# Altium project ZLS_MCU_New.PrjPCB (part 3 of 4)

## Sheet Power_Input.SchDoc: Power Input
size OrCAD A; DocumentNumber: LM-008; Revision: B; SheetNumber: 1; SheetTotal: 6; DocumentName: LM-008
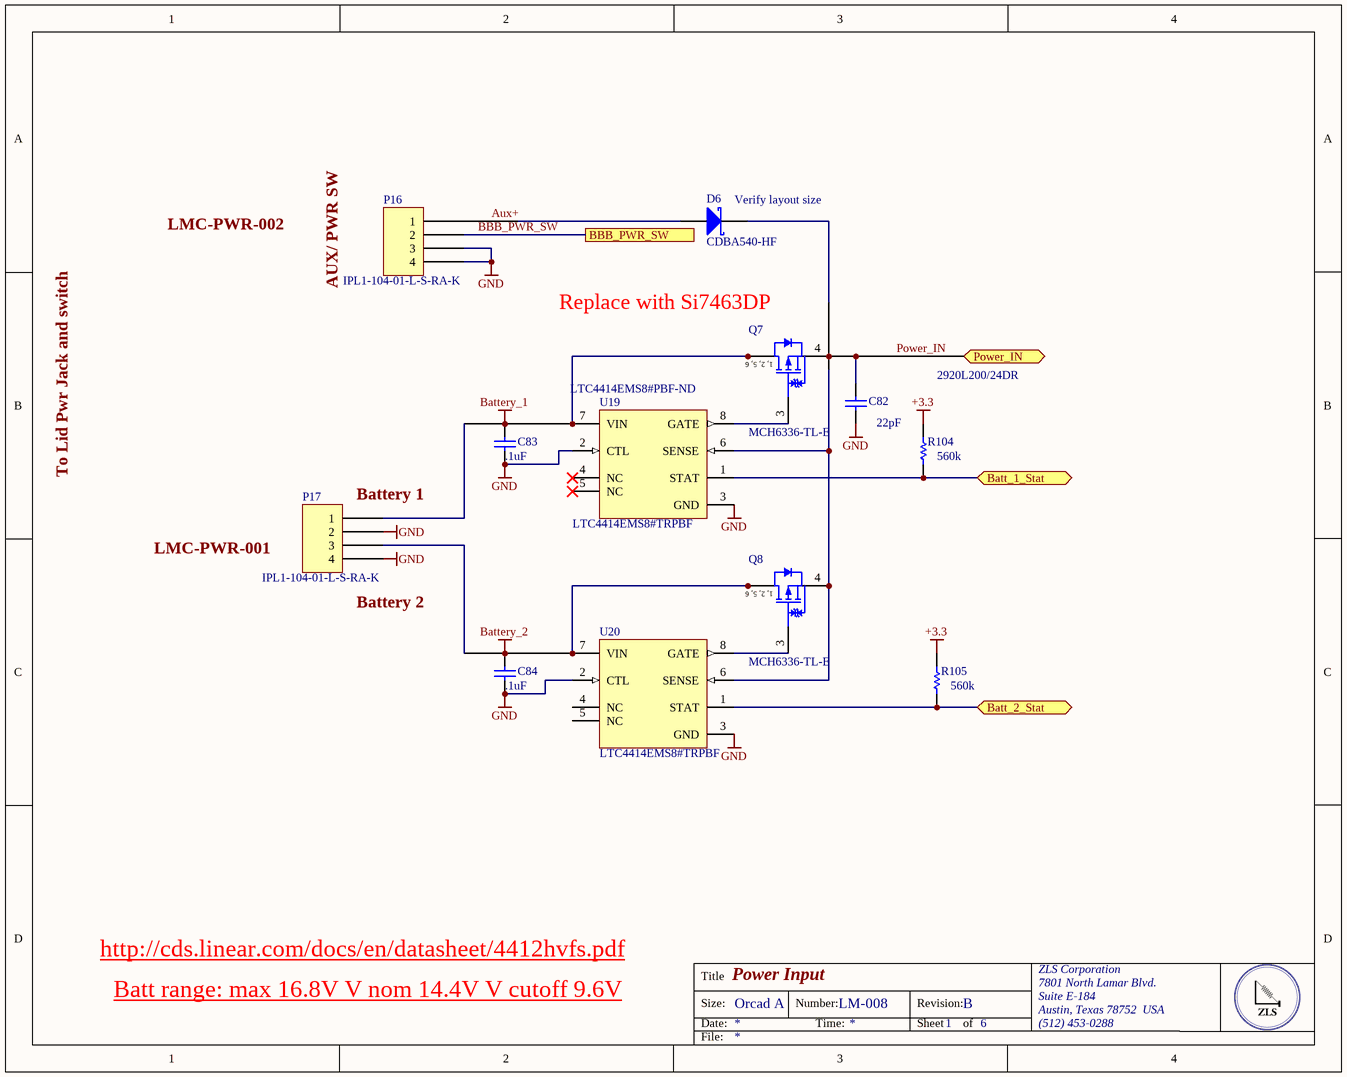
[diagram p5: Power_Input.SchDoc]

### Parts
C82  Capacitance: 22pF  [CAPC1206(3216)130_N]  (hidden comment: CAP CER 10UF 6.3V X5R 1206)
C83  Capacitance: .1uF  [CAPC1206(3216)130_N]  (hidden comment: CAP CER 10UF 6.3V X5R 1206)
C84  Capacitance: .1uF  [CAPC1206(3216)130_N]  (hidden comment: CAP CER 10UF 6.3V X5R 1206)
D6  CDBA540-HF  [VISH-DO-214AC-2_M]
P16  IPL1-104-01-L-S-RA-K  [IPL1-104-01-L-S-RA-K]
P17  IPL1-104-01-L-S-RA-K  [IPL1-104-01-L-S-RA-K]
Q7  MCH6336-TL-E  [ONSC-MCPH-6_V]
Q8  MCH6336-TL-E  [ONSC-MCPH-6_V]
R104  560k  [RESC0402(1005)_L]
R105  560k  [RESC0402(1005)_L]
U19  LTC4414EMS8#TRPBF  Supplier Part Number 1: LTC4414EMS8#PBF-ND  [LT-MS8-8_L]
U20  LTC4414EMS8#TRPBF  [LT-MS8-8_L]

### Ports
Batt_1_Stat, Batt_2_Stat, BBB_PWR_SW, Power_IN

### Nets
+3.3: R104.2 R105.2
Battery_1: C83.2 P17.1 Q7.1(D) Q7.2(D) Q7.5(D) Q7.6(D) U19.7(VIN)
Battery_2: C84.2 P17.3 Q8.1(D) Q8.2(D) Q8.5(D) Q8.6(D) U20.7(VIN)
GND: C82.1 C83.1 C84.1 P16.3 P16.4 P17.2 P17.4 U19.2(CTL) U19.3(GND) U20.2(CTL) U20.3(GND)
Aux+: D6.1(A) P16.1
BBB_PWR_SW: P16.2 ; port BBB_PWR_SW
Power_IN: C82.2 D6.2(K) Q7.4(S) Q8.4(S) U19.6(SENSE) U20.6(SENSE) ; port Power_IN
NetQ7_3: Q7.3(G) U19.8(GATE)
NetQ8_3: Q8.3(G) U20.8(GATE)
NetR104_1: R104.1 U19.1(STAT) ; port Batt_1_Stat
NetR105_1: R105.1 U20.1(STAT) ; port Batt_2_Stat

Not connected (* = marked no-connect by the designer): U19 4(NC)* 5(NC)*; U20 4(NC) 5(NC)

### Notes on the sheet
- (near D6) Verify layout size
- LMC-PWR-002
- AUX/ PWR SW
- (near Q7) Replace with Si7463DP
- 2920L200/24DR
- To Lid Pwr Jack and switch
- LMC-PWR-001
- (near P17) Battery 1
- (near P17) Battery 2
- http://cds.linear.com/docs/en/datasheet/4412hvfs.pdf
- Batt range: max 16.8V V nom 14.4V V cutoff 9.6V
- Title
- Size:
- Date:
- Orcad A
- Number:
- Time:
- Revision:
- Sheet
- of
- ZLS Corporation
- 7801 North Lamar Blvd.
- Suite E-184
- Austin, Texas 78752  USA
- (512) 453-0288
- File:
- (in symbol CMP-1058-00598-1) 1, 2, 5, 6

### Library data of the parts
C82-C84 = CMP-1037-04913-1: Manufacturer: Taiyo Yuden; Manufacturer Part Number: JMK316BJ106ML-T; Tolerance: ±20%; Notification: Current market demand for these product types have resulted in fluctuating and extending lead times. Lead times may differ.; Supplier 1: Digi-Key; Supplier Part Number 1: 587-5447-1-ND; RoHS: RoHS Compliant; Category: Capacitors; Stock 1: 5600; Pricing 1: 1=0.24, 10=0.161, 100=0.0817, 500=0.05592, 1000=0.04946 (USD); Packaging: Cut Tape (CT); Part Status: Active; Voltage - Rated: 6.3V; Temperature Coefficient: X5R; Operating Temperature: -55°C ~ 85°C; Features: -; Ratings: -; Applications: SMPS Filtering; Failure Rate: -; Mounting Type: Surface Mount, MLCC; Package / Case: 1206 (3216 Metric); Size / Dimension: 0.126" L x 0.063" W (3.20mm x 1.60mm); Height - Seated (Max): -; Thickness (Max): 0.071" (1.80mm); Lead Spacing: -; Lead Style: -; ComponentLink1URL: http://ds.yuden.co.jp/TYCOMPAS/ut/detail.do?productNo=JMK316BJ106ML-T&fileName=JMK316BJ106ML-T_SS&mode=specSheetDownload; ComponentLink1Description: http://ds.yuden.co.jp/TYCOMPAS/ut/detail.do?productNo=JMK316BJ106ML-T&fileName=JMK316BJ106ML-T_SS&mode=specSheetDownload
D6 = D Schottky: DIODE SCHOTTKY 40V 5A DO214AB; Manufacturer: Comchip Technology; Speed: Fast Recovery =< 500ns, > 200mA (Io); Capacitance @ Vr, F: 380pF @ 4V, 1MHz; Supplier 1: Digi-Key; Supplier Part Number 1: 641-1707-6-ND; Manufacturer Part Number: CDBA540-HF; RoHS: RoHS Compliant; Category: Discrete Semiconductor Products; Stock 1: 7367; Pricing 1: 1=0.49, 10=0.381, 25=0.3208, 100=0.2612, 250=0.2164, 500=0.1791, 1000=0.13432, 2500=0.12313 (USD); Packaging: Digi-Reel®; Part Status: Active; Diode Type: Schottky; Current - Average Rectified (Io): 5A; Mounting Type: Surface Mount; Package / Case: DO-214AC, SMA; Supplier Device Package: DO-214AC (SMA); Operating Temperature - Junction: -50°C ~ 150°C; ComponentLink1URL: http://www.comchiptech.com/cms/UserFiles/CDBA540-HF%20Thru505315.%20CDBA5200-HF%20RevC.pdf; ComponentLink1Description: http://www.comchiptech.com/cms/UserFiles/CDBA540-HF%20Thru505315.%20CDBA5200-HF%20RevC.pdf
P16 P17 = IPL1-104-01-L-S-RA-K: Manufacturer: Samtec Inc.; Connector Type: Header; Pitch - Mating: 0.100" (2.54mm); Number of Positions: 4; Number of Positions Loaded: All; Style: Board to Cable/Wire; Shrouding: Shrouded - 4 Wall; Contact Length - Mating: 0.215" (5.46mm); Contact Length - Post: 0.085" (2.16mm); Material Flammability Rating: UL94 V-0; Voltage Rating: 675VAC, 954VDC; Supplier 1: Digi-Key; Supplier Part Number 1: SAM9597-ND; Manufacturer Part Number: IPL1-104-01-L-S-RA-K; RoHS: RoHS Compliant; Category: Connectors, Interconnects; Stock 1: 265; Pricing 1: 1=2.53, 10=2.424, 100=2.02, 500=1.717, 1000=1.4645, 5000=1.313 (USD); Packaging: Tube; Part Status: Active; Contact Type: Male Pin; Number of Rows: 1; Row Spacing - Mating: -; Mounting Type: Through Hole, Right Angle; Termination: Solder; Fastening Type: Locking Ramp; Overall Contact Length: -; Insulation Height: 0.240" (6.10mm); Contact Shape: Square; Contact Finish - Mating: Gold; Contact Finish Thickness - Mating: 10µin (0.25µm); Contact Finish - Post: Tin; Contact Material: Phosphor Bronze; Insulation Material: Liquid Crystal Polymer (LCP); Features: -; Operating Temperature: -55°C ~ 125°C; Ingress Protection: -; Insulation Color: Natural; Current Rating: -; Mated Stacking Heights: -; Contact Finish Thickness - Post: -; Applications: -; ComponentLink1URL: http://suddendocs.samtec.com/prints/ipl1-1xx-xx-xxx-s-xx-x-xx-mkt.pdf; ComponentLink1Description: http://suddendocs.samtec.com/prints/ipl1-1xx-xx-xxx-s-xx-x-xx-mkt.pdf
Q7 Q8 = CMP-1058-00598-1: P-Channel Power MOSFET, -12 V, -5 A, 43 mOhm, Single, 6-Pin MCPH, Pb-Free, Tape and Reel; Manufacturer: ON Semiconductor; Current - Continuous Drain (Id) @ 25°C: 5A (Ta); Drive Voltage (Max Rds On,  Min Rds On): 1.8V, 4.5V; Rds On (Max) @ Id, Vgs: 43 mOhm @ 3A, 4.5V; Vgs(th) (Max) @ Id: 1.4V @ 1mA; Vgs (Max): ±10V; Power Dissipation (Max): 1.5W (Ta); Supplier 1: Digi-Key; Supplier Part Number 1: MCH6336-TL-EOSCT-ND; Manufacturer Part Number: MCH6336-TL-E; RoHS: Request Inventory Verification; Category: Discrete Semiconductor Products; Stock 1: 3000; Pricing 1: 1=0.68, 10=0.569, 100=0.4264, 500=0.3127, 1000=0.24164 (USD); Packaging: Cut Tape (CT); Part Status: Active; FET Type: P-Channel; Technology: MOSFET (Metal Oxide); FET Feature: -; Operating Temperature: 150°C (TJ); Mounting Type: Surface Mount; Supplier Device Package: SC-88FL/MCPH6; Package / Case: 6-SMD, Flat Leads; ComponentLink1URL: http://www.onsemi.com/pub/Collateral/MCH6336-D.PDF; ComponentLink1Description: http://www.onsemi.com/pub/Collateral/MCH6336-D.PDF
R104 R105 = CMP-1011-00927-1: RES SMD 560K OHM 1% 1/10W 0402; Manufacturer: Panasonic Electronic Components; Manufacturer Part Number: ERJ-2RKF5603X; Power (Watts): 0.1W, 1/10W; Temperature Coefficient: ±100ppm/°C; Supplier 1: Digi-Key; Supplier Part Number 1: P560KLCT-ND; RoHS: RoHS Compliant; Category: Resistors; Stock 1: 193515; Pricing 1: 1=0.1, 10=0.056, 100=0.0227, 1000=0.01021, 2500=0.00886, 5000=0.00732 (USD); Packaging: Cut Tape (CT); Part Status: Active; Tolerance: ±1%; Composition: Thick Film; Features: Automotive AEC-Q200; Operating Temperature: -55°C ~ 155°C; Package / Case: 0402 (1005 Metric); Supplier Device Package: 0402; Size / Dimension: 0.039" L x 0.020" W (1.00mm x 0.50mm); Height - Seated (Max): 0.016" (0.40mm); Failure Rate: -; ComponentLink1URL: https://industrial.panasonic.com/cdbs/www-data/pdf/RDA0000/AOA0000C304.pdf; ComponentLink1Description: https://industrial.panasonic.com/cdbs/www-data/pdf/RDA0000/AOA0000C304.pdf
U19 U20 = CMP-0479-00214-1: Low Loss PowerPath Controller for Large PFET, 3 to 36 V Vin, 8-pin SOP (MS8-8), -40 to 85 degC, Pb-Free, Tape and Reel; Manufacturer: Linear Technology/Analog Devices; Manufacturer Part Number: LTC4414EMS8#PBF; FET Type: P-Channel; Ratio - Input:Output: 2:1; Internal Switch(s): No; Voltage - Supply: 3 V ~ 36 V; Supplier 1: Digi-Key; RoHS: RoHS Compliant; Category: Integrated Circuits (ICs); Stock 1: 414; Pricing 1: 1=3.79, 25=2.6928, 100=2.2236 (USD); Packaging: Tube; Part Status: Active; Type: Source Selector Switch; Current - Output (Max): -; Applications: Battery Backup, Industrial/Automotive, High Current Switch; Operating Temperature: -40°C ~ 85°C; Mounting Type: Surface Mount; Package / Case: 8-TSSOP, 8-MSOP (0.118", 3.00mm Width); Supplier Device Package: 8-MSOP; Base Part Number: LTC4414; ComponentLink1URL: http://www.linear.com/docs/9037; ComponentLink1Description: http://www.linear.com/docs/9037
  U20: Supplier Part Number 1: LTC4414EMS8#PBF-ND

## Sheet Signal_Conditioner.SchDoc: Signal Conditioner
size Tabloid; DocumentNumber: LM-001; Revision: C; SheetNumber: 2; SheetTotal: 2; DocumentName: Signal Conditioner
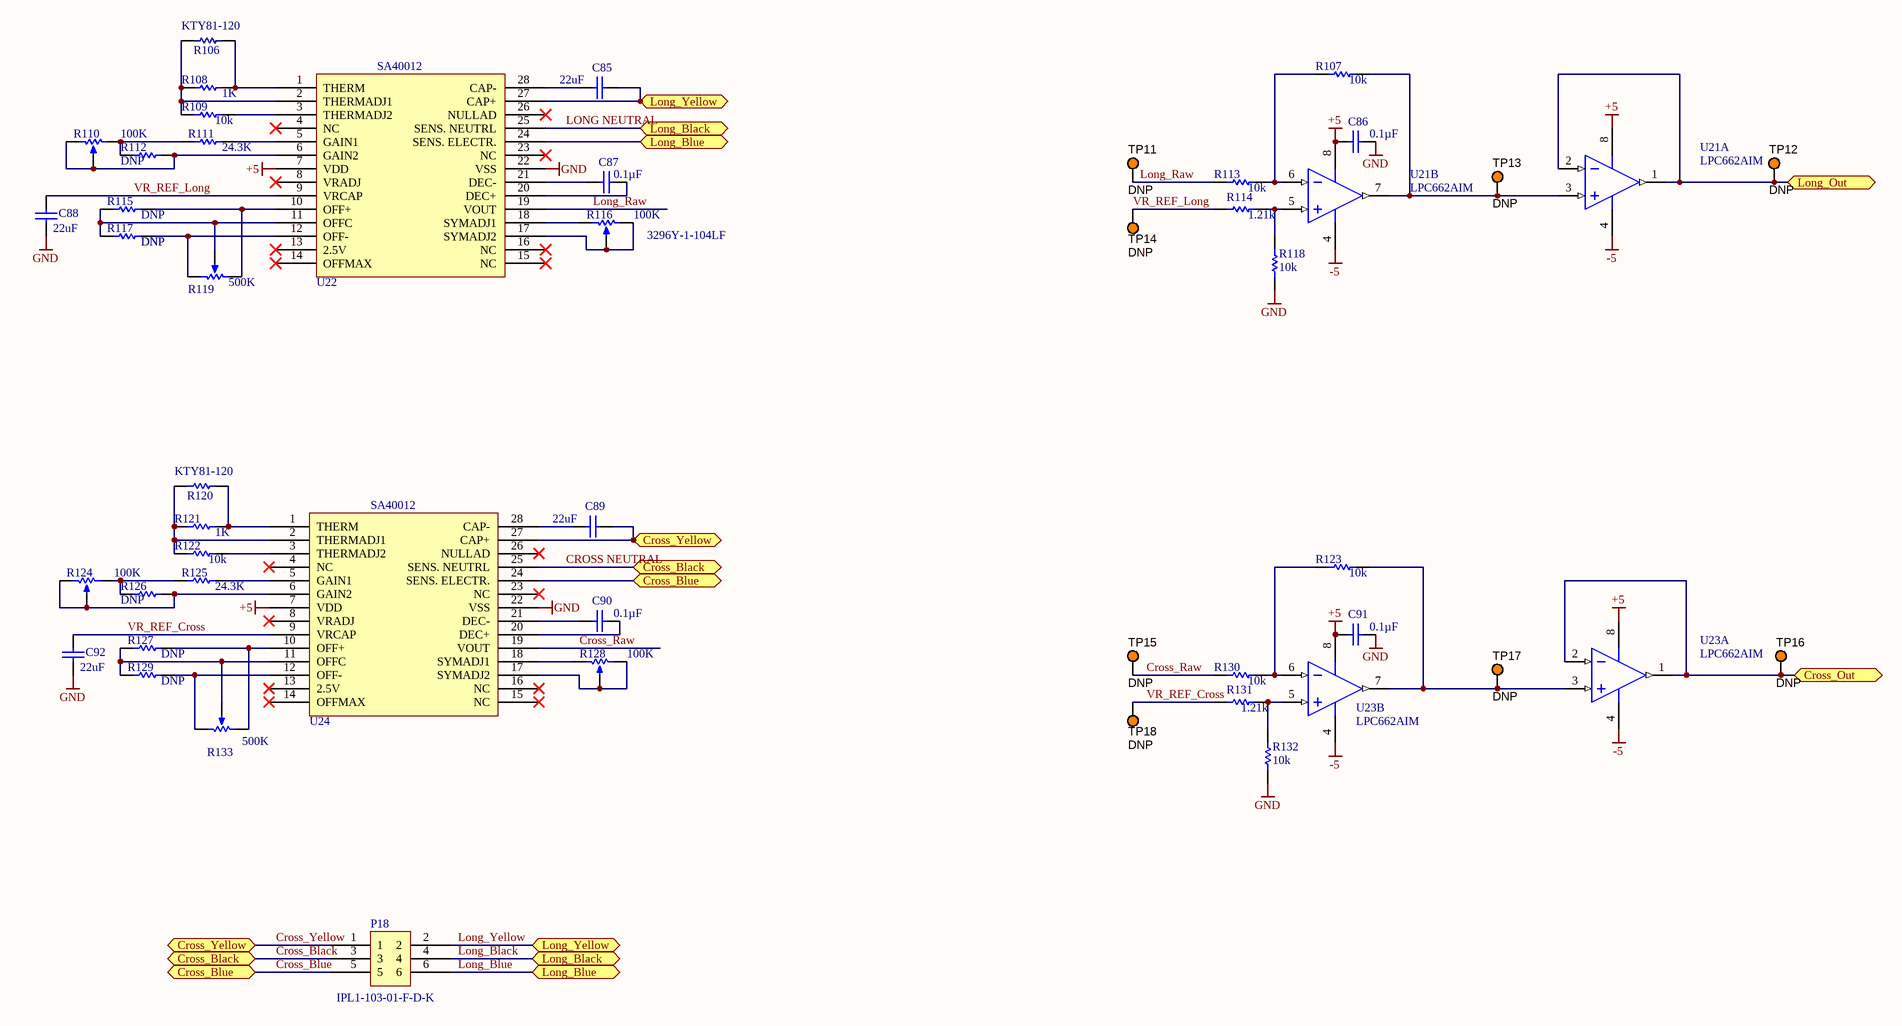
[diagram p6: Signal_Conditioner.SchDoc]

### Parts
C85  22uF  [CAPC0805(2012)145_N]
C86  Capacitance: 0.1µF  [CAPC0805(2012)145_N]  (hidden comment: CAP CER 0.1UF 25V X7R 0805)
C87  Capacitance: 0.1µF  [CAPC0805(2012)145_N]  (hidden comment: CAP CER 0.1UF 25V X7R 0805)
C88  22uF  [CAPC0805(2012)145_N]
C89  22uF  [CAPC0805(2012)145_N]
C90  Capacitance: 0.1µF  [CAPC0805(2012)145_N]  (hidden comment: CAP CER 0.1UF 25V X7R 0805)
C91  Capacitance: 0.1µF  [CAPC0805(2012)145_N]  (hidden comment: CAP CER 0.1UF 25V X7R 0805)
C92  22uF  [CAPC0805(2012)145_N]
P18  Manufacturer Part Number: IPL1-103-01-F-D-K  [IPL1-103-01-F-D]  (hidden comment: IPL1-103-01-F-D)
R106  KTY81-120  [KTY81-120]
R107  10k  [RESC0805(2012)_L]
R108  1K  [RESC0805(2012)_L]
R109  10k  [RESC0805(2012)_L]
R110  100K  [Trimmer 2.54]
R111  24.3K  [RESC0805(2012)_L]
R112  DNP  [RESC0805(2012)_L]
R113  10k  [RESC0805(2012)_L]
R114  1.21k  [RESC0805(2012)_L]
R115  DNP  [RESC0805(2012)_L]
R116  100K  [Trimmer 2.54]
R117  DNP  [RESC0805(2012)_L]
R118  10k  [RESC0805(2012)_L]
R119  500K  [Trimmer 2.54]
R120  KTY81-120  [KTY81-120]
R121  1K  [RESC0805(2012)_L]
R122  10k  [RESC0805(2012)_L]
R123  10k  [RESC0805(2012)_L]
R124  100K  [Trimmer 2.54]
R125  24.3K  [RESC0805(2012)_L]
R126  DNP  [RESC0805(2012)_L]
R127  DNP  [RESC0805(2012)_L]
R128  100K  [Trimmer 2.54]
R129  DNP  [RESC0805(2012)_L]
R130  10k  [RESC0805(2012)_L]
R131  1.21k  [RESC0805(2012)_L]
R132  10k  [RESC0805(2012)_L]
R133  500K  [Trimmer 2.54]
TP11  DNP  [KSTN-5003]
TP12  DNP  [KSTN-5003]
TP13  DNP  [KSTN-5003]
TP14  DNP  [KSTN-5003]
TP15  DNP  [KSTN-5003]
TP16  DNP  [KSTN-5003]
TP17  DNP  [KSTN-5003]
TP18  DNP  [KSTN-5003]
U21  LPC662AIM  [D0008A_M]  (parts A,B of 2)
U22  SA40012  [SA40012]
U23  LPC662AIM  [D0008A_M]  (parts A,B of 2)
U24  SA40012  [SA40012]

### Ports
Cross_Black, Cross_Blue, Cross_Out, Cross_Yellow, Long_Black, Long_Blue, Long_Out, Long_Yellow

### Nets
+5: C86.1 C91.1 U21.8(V+) U22.7(VDD) U23.8(V+) U24.7(VDD)
-5: U21.4(V-) U23.4(V-)
GND: C86.2 C88.2 C91.2 C92.2 R118.1 R132.1 U22.22(VSS) U24.22(VSS)
CROSS NEUTRAL: P18.3 U24.25(SENS._NEUTRL) ; port Cross_Black  [also labelled Cross_Black]
Cross_Blue: P18.5 U24.24(SENS._ELECTR.) ; port Cross_Blue
Cross_Raw: R130.1 TP15.1 U24.19(VOUT)
Cross_Yellow: C89.2 P18.1 U24.27(CAP+) ; port Cross_Yellow
LONG NEUTRAL: P18.4 U22.25(SENS._NEUTRL) ; port Long_Black  [also labelled Long_Black]
Long_Blue: P18.6 U22.24(SENS._ELECTR.) ; port Long_Blue
Long_Raw: R113.1 TP11.1 U22.19(VOUT)
Long_Yellow: C85.2 P18.2 U22.27(CAP+) ; port Long_Yellow
VR_REF_Cross: C92.1 R131.2 TP18.1 U24.9(VRCAP)
VR_REF_Long: C88.1 R114.2 TP14.1 U22.9(VRCAP)
NetC85_1: C85.1 U22.28(CAP-)
NetC87_1: C87.1 U22.21(DEC-)
NetC87_2: C87.2 U22.20(DEC+)
NetC89_1: C89.1 U24.28(CAP-)
NetC90_1: C90.1 U24.21(DEC-)
NetC90_2: C90.2 U24.20(DEC+)
NetR106_1: R106.1 R108.1 R109.1 U22.2(THERMADJ1)
NetR106_2: R106.2 R108.2 U22.1(THERM)
NetR107_1: R107.1 R113.2 U21.6(INB-)
NetR107_2: R107.2 TP13.1 U21.3(INA+) U21.7(OUTB)
NetR109_2: R109.2 U22.3(THERMADJ2)
NetR110_1: R110.1(a) R110.2(b) R112.2 U22.6(GAIN2)
NetR110_3: R110.3(c) R111.1 R112.1
NetR111_2: R111.2 U22.5(GAIN1)
NetR114_1: R114.1 R118.2 U21.5(INB+)
NetR115_1: R115.1 R117.1 R119.2(b) U22.11(OFFC)
NetR115_2: R115.2 R119.1(a) U22.10(OFF+)
NetR116_1: R116.1(a) U22.18(SYMADJ1)
NetR116_2: R116.2(b) R116.3(c) U22.17(SYMADJ2)
NetR117_2: R117.2 R119.3(c) U22.12(OFF-)
NetR120_1: R120.1 R121.1 R122.1 U24.2(THERMADJ1)
NetR120_2: R120.2 R121.2 U24.1(THERM)
NetR122_2: R122.2 U24.3(THERMADJ2)
NetR123_1: R123.1 R130.2 U23.6(INB-)
NetR123_2: R123.2 TP17.1 U23.3(INA+) U23.7(OUTB)
NetR124_1: R124.1(a) R124.2(b) R126.2 U24.6(GAIN2)
NetR124_3: R124.3(c) R125.1 R126.1
NetR125_2: R125.2 U24.5(GAIN1)
NetR127_1: R127.1 R129.1 R133.2(b) U24.11(OFFC)
NetR127_2: R127.2 R133.1(a) U24.10(OFF+)
NetR128_1: R128.1(a) U24.18(SYMADJ1)
NetR128_2: R128.2(b) R128.3(c) U24.17(SYMADJ2)
NetR129_2: R129.2 R133.3(c) U24.12(OFF-)
NetR131_1: R131.1 R132.2 U23.5(INB+)
NetTP12_1: TP12.1 U21.1(OUTA) U21.2(INA-) ; port Long_Out
NetTP16_1: TP16.1 U23.1(OUTA) U23.2(INA-) ; port Cross_Out

Not connected (* = marked no-connect by the designer): U22 4(NC)* 8(VRADJ)* 13(2.5V)* 14(OFFMAX)* 15(NC)* 16(NC)* 23(NC)* 26(NULLAD)*; U24 4(NC)* 8(VRADJ)* 13(2.5V)* 14(OFFMAX)* 15(NC)* 16(NC)* 23(NC)* 26(NULLAD)*

### Notes on the sheet
- (near R117) DNP
- (near R116) 3296Y-1-104LF
- Title
- Size:
- Date:
- Tabloid
- Number:
- Time:
- Revision:
- Sheet
- of
- ZLS Corporation
- 7801 North Lamar Blvd.
- Suite E-184
- Austin, Texas 78752  USA
- (512) 453-0288
- File:

### Library data of the parts
C85 C88 C89 C92 = CMP-1036-04795-1: CAP CER 22UF 16V X5R 0805; Manufacturer: Murata Electronics North America; Manufacturer Part Number: GRM219R61C226ME15L; Tolerance: ±20%; Notification: Current market demand for these product types have resulted in fluctuating and extending lead times. Lead times may differ.; Supplier 1: Digi-Key; Supplier Part Number 1: 490-9952-1-ND; RoHS: RoHS Compliant; Category: Capacitors; Stock 1: 200; Pricing 1: 1=0.51, 10=0.359, 100=0.2364, 500=0.1751, 1000=0.14884 (USD); Packaging: Cut Tape (CT); Part Status: Active; Voltage - Rated: 16V; Temperature Coefficient: X5R; Operating Temperature: -55°C ~ 85°C; Features: -; Ratings: -; Applications: General Purpose; Mounting Type: Surface Mount, MLCC; Package / Case: 0805 (2012 Metric); Size / Dimension: 0.079" L x 0.049" W (2.00mm x 1.25mm); Height - Seated (Max): -; Thickness (Max): 0.039" (1.00mm); Lead Spacing: -; Lead Style: -; ComponentLink1URL: http://search.murata.co.jp/Ceramy/image/img/A01X/G101/ENG/GRM219R61C226ME15-01.pdf; ComponentLink1Description: http://search.murata.co.jp/Ceramy/image/img/A01X/G101/ENG/GRM219R61C226ME15-01.pdf
C86 C87 C90 C91 = CMP-1036-04795-1: Manufacturer: Murata Electronics North America; Manufacturer Part Number: GRM21BR71E104KA01L; Tolerance: ±10%; Supplier 1: Digi-Key; Supplier Part Number 1: 490-1673-6-ND; RoHS: RoHS Compliant; Category: Capacitors; Stock 1: 891652; Pricing 1: 1=0.2, 10=0.145, 100=0.0683, 500=0.04788, 1000=0.03964 (USD); Packaging: Digi-Reel®; Part Status: Active; Voltage - Rated: 25V; Temperature Coefficient: X7R; Operating Temperature: -55°C ~ 125°C; Features: -; Ratings: -; Applications: General Purpose; Mounting Type: Surface Mount, MLCC; Package / Case: 0805 (2012 Metric); Size / Dimension: 0.079" L x 0.049" W (2.00mm x 1.25mm); Height - Seated (Max): -; Thickness (Max): 0.053" (1.35mm); Lead Spacing: -; Lead Style: -; ComponentLink1URL: http://www.murata.com/~/media/webrenewal/support/library/catalog/products/capacitor/mlcc/c02e.ashx; ComponentLink1Description: http://www.murata.com/~/media/webrenewal/support/library/catalog/products/capacitor/mlcc/c02e.ashx
P18 = IPL1-103-01-F-D: Manufacturer: SAMTEC; Supplier 1: Newark; Supplier Part Number 1: 51P2678; Stock 1: 0; Pricing 1: 1=1.8, 5000=1.56, 10000=1.46 (USD); ComponentLink1URL: https://webassistants.partcommunity.com/23d-libs/samtec/search/resolve.html?EMAIL=mysamtec@samtec.com&PN=HTSW-114-05-F-D; ComponentLink1Description: https://webassistants.partcommunity.com/23d-libs/samtec/search/resolve.html?EMAIL=mysamtec@samtec.com&PN=HTSW-114-05-F-D
R106 R120 = KTY81-120: THERMISTOR PTC 1K OHM PBCYT2; Manufacturer: NXP USA Inc.; Manufacturer Part Number: KTY81/120,112; Supplier 1: Digi-Key; Supplier Part Number 1: 568-12506-ND; RoHS: RoHS Compliant; Category: Sensors, Transducers; Stock 1: 2002; Pricing 1: 1=1.11, 5=1.068, 10=0.868, 25=0.748, 50=0.648, 100=0.5878, 500=0.49432, 1000=0.44088, 5000=0.4008 (USD); Packaging: Bulk; Part Status: Active; Resistance Tolerance: -; Operating Temperature: -55°C ~ 150°C; Mounting Type: Through Hole; Package / Case: TO-226-2, TO-92-2 (TO-226AC); Supplier Device Package: PBCYT2; ComponentLink1URL: http://www.nxp.com/documents/data_sheet/KTY81_SER.pdf; ComponentLink1Description: http://www.nxp.com/documents/data_sheet/KTY81_SER.pdf
R107 R109 R112 R113 R118 R122 R123 R126 R130 R132 = CMP-1013-00393-1: RES SMD 10K OHM 1% 1/8W 0805; Manufacturer: Vishay Dale; Manufacturer Part Number: CRCW080510K0FKEA; Power (Watts): 0.125W, 1/8W; Temperature Coefficient: ±100ppm/°C; Supplier 1: Digi-Key; Supplier Part Number 1: 541-10.0KCCT-ND; RoHS: RoHS Compliant; Category: Resistors; Stock 1: 1858038; Pricing 1: 1=0.1, 10=0.055, 100=0.0223, 1000=0.01003, 2500=0.0087 (USD); Packaging: Cut Tape (CT); Part Status: Active; Tolerance: ±1%; Composition: Thick Film; Features: Automotive AEC-Q200; Operating Temperature: -55°C ~ 155°C; Package / Case: 0805 (2012 Metric); Supplier Device Package: 0805; Size / Dimension: 0.079" L x 0.049" W (2.00mm x 1.25mm); Height - Seated (Max): 0.020" (0.50mm); Failure Rate: -; ComponentLink1URL: http://www.vishay.com/docs/20035/dcrcwe3.pdf; ComponentLink1Description: http://www.vishay.com/docs/20035/dcrcwe3.pdf
R108 R121 = CMP-1013-00393-1: RES SMD 1K OHM 1% 1/8W 0805; Manufacturer: Vishay Dale; Manufacturer Part Number: CRCW08051K00FKEA; Power (Watts): 0.125W, 1/8W; Temperature Coefficient: ±100ppm/°C; Supplier 1: Digi-Key; Supplier Part Number 1: 541-1.00KCCT-ND; RoHS: RoHS Compliant; Category: Resistors; Stock 1: 157631; Pricing 1: 1=0.1, 10=0.055, 100=0.0223, 1000=0.01003, 2500=0.0087 (USD); Packaging: Cut Tape (CT); Part Status: Active; Tolerance: ±1%; Composition: Thick Film; Features: Automotive AEC-Q200; Operating Temperature: -55°C ~ 155°C; Package / Case: 0805 (2012 Metric); Supplier Device Package: 0805; Size / Dimension: 0.079" L x 0.049" W (2.00mm x 1.25mm); Height - Seated (Max): 0.020" (0.50mm); Failure Rate: -; ComponentLink1URL: http://www.vishay.com/docs/20035/dcrcwe3.pdf; ComponentLink1Description: http://www.vishay.com/docs/20035/dcrcwe3.pdf
R110 R116 R124 R128 = Trimmer: TRIMMER 5K OHM 0.25W PC PIN; Manufacturer: Bourns Inc.; Manufacturer Part Number: 3296Y-1-104LF; Power (Watts): 0.5W, 1/2W; Tolerance: ±10%; Temperature Coefficient: ±100ppm/°C; Adjustment Type: Top Adjustment; Resistive Material: Cermet; Supplier 1: Digi-Key; Supplier Part Number 1: 3296Y-104LF-ND; RoHS: RoHS Compliant; Category: Potentiometers, Variable Resistors; Stock 1: 10872; Pricing 1: 1=2.41, 10=2.117, 25=1.898, 50=1.825, 100=1.752, 250=1.679, 500=1.387, 1000=1.314, 5000=1.095 (USD); Packaging: Tube; Part Status: Active; Mounting Type: Through Hole; Termination Style: PC Pins; Size / Dimension: Rectangular - 0.375" x 0.190" Face x 0.395" H (9.53mm x 4.83mm x 10.03mm); ComponentLink1URL: https://www.bourns.com/docs/Product-Datasheets/3296.pdf; ComponentLink1Description: https://www.bourns.com/docs/Product-Datasheets/3296.pdf
R111 R125 = CMP-1013-00393-1: RES SMD 24.3K OHM 1% 1/8W 0805; Manufacturer: Vishay Dale; Manufacturer Part Number: CRCW080524K3FKEA; Power (Watts): 0.125W, 1/8W; Temperature Coefficient: ±100ppm/°C; Supplier 1: Digi-Key; Supplier Part Number 1: 541-24.3KCCT-ND; RoHS: RoHS Compliant; Category: Resistors; Stock 1: 35; Pricing 1: 1=0.1, 10=0.055, 100=0.0223, 1000=0.01003, 2500=0.0087 (USD); Packaging: Cut Tape (CT); Part Status: Active; Tolerance: ±1%; Composition: Thick Film; Features: Automotive AEC-Q200; Operating Temperature: -55°C ~ 155°C; Package / Case: 0805 (2012 Metric); Supplier Device Package: 0805; Size / Dimension: 0.079" L x 0.049" W (2.00mm x 1.25mm); Height - Seated (Max): 0.020" (0.50mm); Failure Rate: -; ComponentLink1URL: http://www.vishay.com/docs/20035/dcrcwe3.pdf; ComponentLink1Description: http://www.vishay.com/docs/20035/dcrcwe3.pdf
R114 R131 = CMP-1013-00393-1: RES SMD 1.21K OHM 1% 1/8W 0805; Manufacturer: Vishay Dale; Manufacturer Part Number: CRCW08051K21FKEA; Power (Watts): 0.125W, 1/8W; Temperature Coefficient: ±100ppm/°C; Supplier 1: Digi-Key; Supplier Part Number 1: 541-1.21KCCT-ND; RoHS: RoHS Compliant; Category: Resistors; Stock 1: 93438; Pricing 1: 1=0.1, 10=0.055, 100=0.0223, 1000=0.01003, 2500=0.0087 (USD); Packaging: Cut Tape (CT); Part Status: Active; Tolerance: ±1%; Composition: Thick Film; Features: Automotive AEC-Q200; Operating Temperature: -55°C ~ 155°C; Package / Case: 0805 (2012 Metric); Supplier Device Package: 0805; Size / Dimension: 0.079" L x 0.049" W (2.00mm x 1.25mm); Height - Seated (Max): 0.020" (0.50mm); Failure Rate: -; ComponentLink1URL: http://www.vishay.com/docs/20035/dcrcwe3.pdf; ComponentLink1Description: http://www.vishay.com/docs/20035/dcrcwe3.pdf
R115 R117 R127 R129 = CMP-1013-00393-1: RES SMD 249K OHM 1% 1/8W 0805; Manufacturer: Vishay Dale; Manufacturer Part Number: CRCW0805249KFKECC; Power (Watts): 0.125W, 1/8W; Temperature Coefficient: ±100ppm/°C; Supplier 1: Digi-Key; Supplier Part Number 1: 541-4128-1-ND; RoHS: RoHS Compliant; Category: Resistors; Stock 1: 19464; Pricing 1: 1=0.1, 10=0.06, 100=0.0244, 1000=0.01094, 2500=0.0095, 5000=0.00785 (USD); Packaging: Cut Tape (CT); Part Status: Active; Tolerance: ±1%; Composition: Thick Film; Features: -; Operating Temperature: -55°C ~ 155°C; Package / Case: 0805 (2012 Metric); Supplier Device Package: 0805; Size / Dimension: 0.079" L x 0.049" W (2.00mm x 1.25mm); Height - Seated (Max): 0.024" (0.60mm); Failure Rate: -; ComponentLink1URL: http://www.vishay.com/docs/28773/crcwce3.pdf; ComponentLink1Description: http://www.vishay.com/docs/28773/crcwce3.pdf
R119 R133 = Trimmer: TRIMMER 500K OHM 0.5W PC PIN TOP; Manufacturer: Bourns Inc.; Manufacturer Part Number: 3296Y-1-504LF; Power (Watts): 0.5W, 1/2W; Tolerance: ±10%; Temperature Coefficient: ±100ppm/°C; Adjustment Type: Top Adjustment; Resistive Material: Cermet; Supplier 1: Digi-Key; Supplier Part Number 1: 3296Y-504LF-ND; RoHS: RoHS Compliant; Category: Potentiometers, Variable Resistors; Stock 1: 2109; Pricing 1: 1=2.41, 10=2.117, 25=1.898, 50=1.825, 100=1.752, 300=1.679, 500=1.387, 1000=1.314, 5000=1.095 (USD); Packaging: Tube; Part Status: Active; Mounting Type: Through Hole; Termination Style: PC Pins; Size / Dimension: Rectangular - 0.375" x 0.190" Face x 0.395" H (9.53mm x 4.83mm x 10.03mm); ComponentLink1URL: https://www.bourns.com/docs/Product-Datasheets/3296.pdf; ComponentLink1Description: https://www.bourns.com/docs/Product-Datasheets/3296.pdf
TP11-TP18 = CMP-1672-00009-1: Test Point, Orange, 1-Pin THD, RoHS; Manufacturer: Keystone Electronics; Manufacturer Part Number: 5003; Peak Reverse Current: 600 uA; Forward Current: 3 A; Max Surge Current: 80 A; Forward Voltage: 1.08 V; Plating: Silver; Body Material: PBT; Outside Diameter: 2.54mm; Inside Diameter: 1.27mm; Max Operating Temperature: 150 degC; PackageReference: 5003; Pins: 2; ComponentLink2URL: http://keyelco.com/userAssets/file/M65p56.pdf; PackageDescription: 1-Pin Through Hole Device, Dia 2.54 mm; Weight: 0.01 lb; Diameter: 5.3 mm; Mount: Through Hole; Package Quantity: 500; Packaging: Bulk; Min Operating Temperature: -65 degC; ComponentLink1Description: Manufacturer URL; Height: 0.25 inch; ComponentLink1URL: http://www.keyelco.com/; ComponentLink2Description: Datasheet; Width: 0.25 inch; REACH SVHC: No SVHC; RoHSCompliant: true; Radiation Hardening: No; Length: 9.5 mm; DatasheetVersion: Jun-15; Supplier 1: Future Electronics; Supplier Part Number 1: 1432640; Stock 1: 5752; Pricing 1: 100=0.176, 500=0.148, 1000=0.146, 2000=0.143, 4000=0.141 (USD); Number of Pins: 1; Colour: Orange,White; Contact Material: Bronze; Contact Plating: Silver,Tin; Material: Bronze,Nylon,Silver; Termination: Through Hole; Lead Free: Lead Free; Flammability Rating: UL94 V-0
U21 = CMP-0055-00867-3: Low Power CMOS Dual Operational Amplifier, 8-pin Narrow SOIC; Manufacturer: Texas Instruments; PowerWise: N; CompType: Amplifiers; PackageTopMarking: NSZXTT*LPC66*2AIM; PinCount: 8; Code_JEDEC: MS-012-AA; ComponentLink1URL: http://www.ti.com/general/docs/lit/getliterature.tsp?genericPartNumber=LPC662&fileType=pdf; Code_IPC: SOIC127P600-8; Package Reference: D0008A; PackageDescription: SOIC Narrow, 4.9 x 3.9 x 1.45mm, 8 Lead, 1.27mm Pitch; RoHS: N; ComponentLink1Description: Datasheet URL; PartId: 1
U22 U24 = SA40012: Single Axix CMOS Signal Conditioning Module; Manufacturer: Spectron; Manufacturer Part Number: A40012
U23 = CMP-0055-00867-3: Low Power CMOS Dual Operational Amplifier, 8-pin Narrow SOIC; Manufacturer: Texas Instruments; Manufacturer Part Number: LPC662AIMX/NOPB; Amplifier Type: General Purpose; Output Type: Rail-to-Rail; Slew Rate: 0.11 V/µs; Current - Supply: 86µA; Voltage - Supply, Single/Dual (±): 4.75 V ~ 15.5 V, ±2.38 V ~ 7.75 V; Supplier 1: Digi-Key; Supplier Part Number 1: 296-35456-1-ND; RoHS: RoHS Compliant; Category: Integrated Circuits (ICs); Stock 1: 4976; Pricing 1: 1=2.98, 10=2.672, 100=2.1893, 500=1.86368, 1000=1.57178 (USD); Packaging: Cut Tape (CT); Part Status: Active; Operating Temperature: -40°C ~ 85°C; Mounting Type: Surface Mount; Package / Case: 8-SOIC (0.154", 3.90mm Width); Supplier Device Package: 8-SOIC; Base Part Number: LPC662; ComponentLink1URL: http://www.ti.com/lit/ds/symlink/lpc662.pdf; ComponentLink1Description: http://www.ti.com/lit/ds/symlink/lpc662.pdf

## Sheet Heater.SchDoc: Land Meter Heater Assembly
size Tabloid; DocumentNumber: LM_HTR_001; Revision: A; SheetNumber: 1; SheetTotal: 1
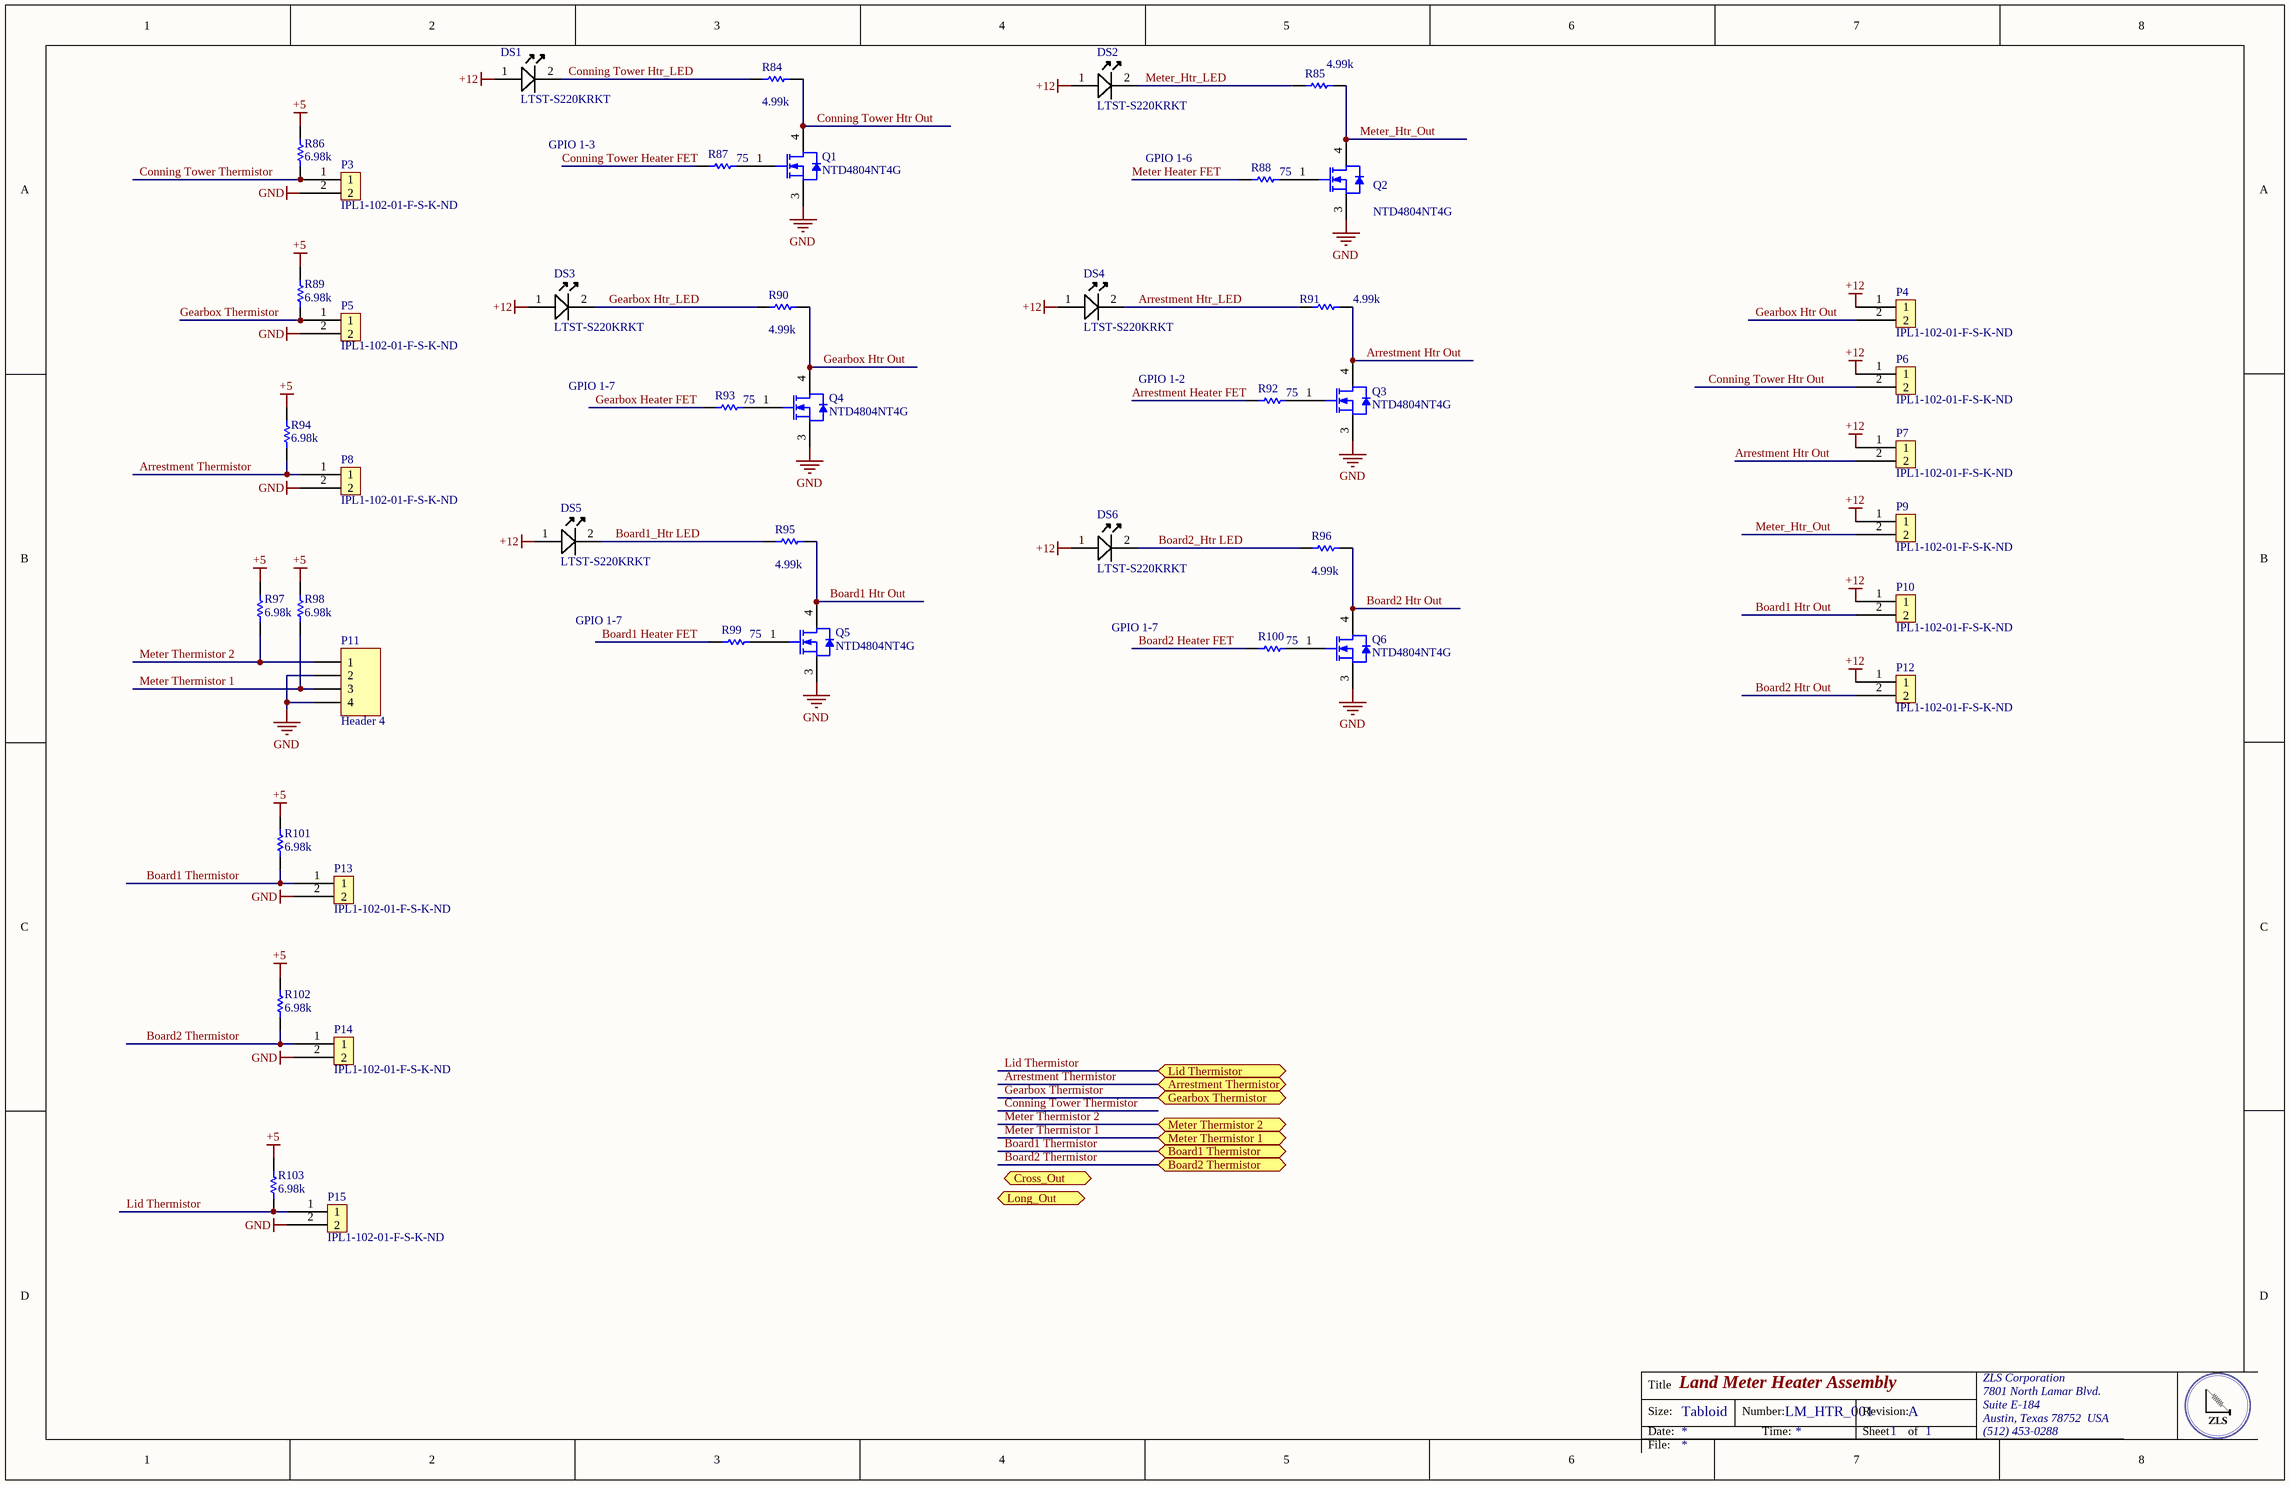
[diagram p7: Heater.SchDoc]

### Parts
DS1  Manufacturer Part Number: LTST-S220KRKT  [0805C_L]  (hidden comment: Visible Name Value Type    False Description Lite-On LTST-S220KRKT Red LED, 631 nm 2012 (0805) Side View, Rectangle Lens SMD package STRING)
DS2  Manufacturer Part Number: LTST-S220KRKT  [0805C_L]  (hidden comment: Visible Name Value Type    False Description Lite-On LTST-S220KRKT Red LED, 631 nm 2012 (0805) Side View, Rectangle Lens SMD package STRING)
DS3  Manufacturer Part Number: LTST-S220KRKT  [0805C_L]  (hidden comment: Visible Name Value Type    False Description Lite-On LTST-S220KRKT Red LED, 631 nm 2012 (0805) Side View, Rectangle Lens SMD package STRING)
DS4  Manufacturer Part Number: LTST-S220KRKT  [0805C_L]  (hidden comment: Visible Name Value Type    False Description Lite-On LTST-S220KRKT Red LED, 631 nm 2012 (0805) Side View, Rectangle Lens SMD package STRING)
DS5  Manufacturer Part Number: LTST-S220KRKT  [0805C_L]  (hidden comment: Visible Name Value Type    False Description Lite-On LTST-S220KRKT Red LED, 631 nm 2012 (0805) Side View, Rectangle Lens SMD package STRING)
DS6  Manufacturer Part Number: LTST-S220KRKT  [0805C_L]  (hidden comment: Visible Name Value Type    False Description Lite-On LTST-S220KRKT Red LED, 631 nm 2012 (0805) Side View, Rectangle Lens SMD package STRING)
P3  Supplier Part Number 1: IPL1-102-01-F-S-K-ND  [IPL1-102-01-F-S-K]  (hidden comment: IPL1-102-01-F-S-K)
P4  Supplier Part Number 1: IPL1-102-01-F-S-K-ND  [IPL1-102-01-F-S-K]  (hidden comment: IPL1-102-01-F-S-K)
P5  Supplier Part Number 1: IPL1-102-01-F-S-K-ND  [IPL1-102-01-F-S-K]  (hidden comment: IPL1-102-01-F-S-K)
P6  Supplier Part Number 1: IPL1-102-01-F-S-K-ND  [IPL1-102-01-F-S-K]  (hidden comment: IPL1-102-01-F-S-K)
P7  Supplier Part Number 1: IPL1-102-01-F-S-K-ND  [IPL1-102-01-F-S-K]  (hidden comment: IPL1-102-01-F-S-K)
P8  Supplier Part Number 1: IPL1-102-01-F-S-K-ND  [IPL1-102-01-F-S-K]  (hidden comment: IPL1-102-01-F-S-K)
P9  Supplier Part Number 1: IPL1-102-01-F-S-K-ND  [IPL1-102-01-F-S-K]  (hidden comment: IPL1-102-01-F-S-K)
P10  Supplier Part Number 1: IPL1-102-01-F-S-K-ND  [IPL1-102-01-F-S-K]  (hidden comment: IPL1-102-01-F-S-K)
P11  Header 4  [IPL1-104-01-L-S-K]
P12  Supplier Part Number 1: IPL1-102-01-F-S-K-ND  [IPL1-102-01-F-S-K]  (hidden comment: IPL1-102-01-F-S-K)
P13  Supplier Part Number 1: IPL1-102-01-F-S-K-ND  [IPL1-102-01-F-S-K]  (hidden comment: IPL1-102-01-F-S-K)
P14  Supplier Part Number 1: IPL1-102-01-F-S-K-ND  [IPL1-102-01-F-S-K]  (hidden comment: IPL1-102-01-F-S-K)
P15  Supplier Part Number 1: IPL1-102-01-F-S-K-ND  [IPL1-102-01-F-S-K]  (hidden comment: IPL1-102-01-F-S-K)
Q1  NTD4804NT4G  [ONSC-DPAK-3-369AA-01_V]
Q2  NTD4804NT4G  [ONSC-DPAK-3-369AA-01_V]
Q3  NTD4804NT4G  [ONSC-DPAK-3-369AA-01_V]
Q4  NTD4804NT4G  [ONSC-DPAK-3-369AA-01_V]
Q5  NTD4804NT4G  [ONSC-DPAK-3-369AA-01_V]
Q6  NTD4804NT4G  [ONSC-DPAK-3-369AA-01_V]
R84  Resistance (Ohms): 4.99k  [RESC0805(2012)_L]
R85  Resistance (Ohms): 4.99k  [RESC0805(2012)_L]
R86  Resistance (Ohms): 6.98k  [RESC0805(2012)_N]  (hidden comment: 6K98 1% 0805(2012))
R87  Resistance (Ohms): 75  [RESC0805(2012)_L]
R88  Resistance (Ohms): 75  [RESC0805(2012)_L]
R89  Resistance (Ohms): 6.98k  [RESC0805(2012)_N]  (hidden comment: 6K98 1% 0805(2012))
R90  Resistance (Ohms): 4.99k  [RESC0805(2012)_L]
R91  Resistance (Ohms): 4.99k  [RESC0805(2012)_L]
R92  Resistance (Ohms): 75  [RESC0805(2012)_L]
R93  Resistance (Ohms): 75  [RESC0805(2012)_L]
R94  Resistance (Ohms): 6.98k  [RESC0805(2012)_N]  (hidden comment: 6K98 1% 0805(2012))
R95  Resistance (Ohms): 4.99k  [RESC0805(2012)_L]
R96  Resistance (Ohms): 4.99k  [RESC0805(2012)_L]
R97  Resistance (Ohms): 6.98k  [RESC0805(2012)_N]  (hidden comment: 6K98 1% 0805(2012))
R98  Resistance (Ohms): 6.98k  [RESC0805(2012)_N]  (hidden comment: 6K98 1% 0805(2012))
R99  Resistance (Ohms): 75  [RESC0805(2012)_L]
R100  Resistance (Ohms): 75  [RESC0805(2012)_L]
R101  Resistance (Ohms): 6.98k  [RESC0805(2012)_N]  (hidden comment: 6K98 1% 0805(2012))
R102  Resistance (Ohms): 6.98k  [RESC0805(2012)_N]  (hidden comment: 6K98 1% 0805(2012))
R103  Resistance (Ohms): 6.98k  [RESC0805(2012)_N]  (hidden comment: 6K98 1% 0805(2012))

### Ports
Arrestment Thermistor, Board1 Thermistor, Board2 Thermistor, Cross_Out, Gearbox Thermistor, Lid Thermistor, Long_Out, Meter Thermistor 1, Meter Thermistor 2

### Nets
+5: R86.2 R89.2 R94.1 R97.1 R98.2 R101.1 R102.1 R103.1
+12: DS1.1(A) DS2.1(A) DS3.1(A) DS4.1(A) DS5.1(A) DS6.1(A) P4.1 P6.1 P7.1 P9.1 P10.1 P12.1
GND: P3.2 P5.2 P8.2 P11.2 P11.4 P13.2 P14.2 P15.2 Q1.3(S) Q2.3(S) Q3.3(S) Q4.3(S) Q5.3(S) Q6.3(S)
Arrestment Heater FET: R92.1
Arrestment Htr Out: P7.2 Q3.4(D) R91.2
Arrestment Htr_LED: DS4.2(K) R91.1
Arrestment Thermistor: P8.1 R94.2 ; port Arrestment Thermistor
Board1 Heater FET: R99.1
Board1 Htr Out: P10.2 Q5.4(D) R95.1
Board1 Thermistor: P13.1 R101.2 ; port Board1 Thermistor
Board1_Htr LED: DS5.2(K) R95.2
Board2 Heater FET: R100.1
Board2 Htr Out: P12.2 Q6.4(D) R96.1
Board2 Thermistor: P14.1 R102.2 ; port Board2 Thermistor
Board2_Htr LED: DS6.2(K) R96.2
Conning Tower Heater FET: R87.1
Conning Tower Htr Out: P6.2 Q1.4(D) R84.1
Conning Tower Htr_LED: DS1.2(K) R84.2
Conning Tower Thermistor: P3.1 R86.1
Gearbox Heater FET: R93.1
Gearbox Htr Out: P4.2 Q4.4(D) R90.1
Gearbox Htr_LED: DS3.2(K) R90.2
Gearbox Thermistor: P5.1 R89.1 ; port Gearbox Thermistor
Lid Thermistor: P15.1 R103.2 ; port Lid Thermistor
Meter Heater FET: R88.1
Meter Thermistor 1: P11.3 R98.1 ; port Meter Thermistor 1
Meter Thermistor 2: P11.1 R97.2 ; port Meter Thermistor 2
Meter_Htr_LED: DS2.2(K) R85.1
Meter_Htr_Out: P9.2 Q2.4(D) R85.2
NetQ1_1: Q1.1(G) R87.2
NetQ2_1: Q2.1(G) R88.2
NetQ3_1: Q3.1(G) R92.2
NetQ4_1: Q4.1(G) R93.2
NetQ5_1: Q5.1(G) R99.2
NetQ6_1: Q6.1(G) R100.2

### Notes on the sheet
- GPIO 1-3
- GPIO 1-6
- GPIO 1-7
- GPIO 1-2
- Title
- Size:
- Date:
- Tabloid
- Number:
- Time:
- Revision:
- Sheet
- of
- ZLS Corporation
- 7801 North Lamar Blvd.
- Suite E-184
- Austin, Texas 78752  USA
- (512) 453-0288
- File:

### Library data of the parts
DS1-DS6 = LED A/K: Manufacturer: Vishay / Lite-On; Lens Colour: Colorless; Lens Style: Diffused,Colorless; Viewing Angle: 130°; Luminous Intensity: 54mcd; Forward Current: 20mA; Forward Voltage: 2V; Power Rating: 75mW; Dominant Wavelength: 631nm; Lens Transparency: Clear; Number of Elements: 1; Wavelength: 639nm; Supplier 1: Digi-Key; Supplier Part Number 1: 160-1469-1-ND; Stock 1: 108191; Pricing 1: 1=0.31, 10=0.225, 25=0.1656, 100=0.1183, 250=0.0804, 500=0.071, 1000=0.0556 (USD); Mount: Surface Mount; Case/Package: 0805; Number of Pins: 2; Colour: Red; Case Code (Metric): 2012; Case Code (Imperial): 0805; Min Operating Temperature: -55°C; Max Operating Temperature: 85°C; Packaging: Tape and Reel; Package Quantity: 4000; Illumination Colour: Red; Test Current: 20mA; Power Dissipation: 75mW; Number of LEDs: 1; Length: 2.1mm; Height: 0.6mm; Width: 1mm; Depth: 0.6mm; Radiation Hardening: No; Lead Free: Lead Free; ComponentLink1URL: https://datasheet.ciiva.com/2110/s-110-ltst-s220krkt-2110132.pdf; ComponentLink1Description: https://datasheet.ciiva.com/2110/s-110-ltst-s220krkt-2110132.pdf; ComponentLink2URL: https://datasheet.ciiva.com/2110/s-110-ltst-s220krkt-2110133.pdf; ComponentLink2Description: https://datasheet.ciiva.com/2110/s-110-ltst-s220krkt-2110133.pdf; ComponentLink3URL: https://datasheet.ciiva.com/2110/s-110-ltst-s220krkt-2110134.pdf; ComponentLink3Description: https://datasheet.ciiva.com/2110/s-110-ltst-s220krkt-2110134.pdf; ComponentLink4URL: https://datasheet.ciiva.com/12403/lite-on-ltst-s220krkt-187389-12403798.pdf; ComponentLink4Description: https://datasheet.ciiva.com/12403/lite-on-ltst-s220krkt-187389-12403798.pdf; ComponentLink5URL: https://datasheet.ciiva.com/16345/lite-onltst-s220krkt-16345511.pdf; ComponentLink5Description: https://datasheet.ciiva.com/16345/lite-onltst-s220krkt-16345511.pdf; ComponentLink6URL: https://datasheet.ciiva.com/15118/getdatasheetpartid-225752-15118120.pdf; ComponentLink6Description: https://datasheet.ciiva.com/15118/getdatasheetpartid-225752-15118120.pdf; ComponentLink7URL: https://datasheet.ciiva.com/14633/0900766b80dc0b76-14633737.pdf; ComponentLink7Description: https://datasheet.ciiva.com/14633/0900766b80dc0b76-14633737.pdf; ComponentLink8URL: https://datasheet.ciiva.com/11775/0900766b80dc0b76-11775439.pdf; ComponentLink8Description: https://datasheet.ciiva.com/11775/0900766b80dc0b76-11775439.pdf
P3-P10 P12-P15 = IPL1-102-01-F-S-K: .100 TERMINAL ASSEMBLY; Manufacturer: Samtec Inc.; Connector Type: Header; Pitch - Mating: 0.100" (2.54mm); Number of Positions: 2; Number of Positions Loaded: All; Style: Board to Cable/Wire; Shrouding: Shrouded - 4 Wall; Contact Length - Mating: 0.215" (5.46mm); Contact Length - Post: 0.120" (3.05mm); Material Flammability Rating: UL94 V-0; Voltage Rating: 675VAC, 954VDC; Supplier 1: Digi-Key; Manufacturer Part Number: IPL1-102-01-F-S-K; RoHS: RoHS Compliant; Category: Connectors, Interconnects; Stock 1: 0; Pricing 1: 1=1.69 (USD); Packaging: Tube; Part Status: Active; Contact Type: Male Pin; Number of Rows: 1; Row Spacing - Mating: -; Mounting Type: Through Hole; Termination: Solder; Fastening Type: Locking Ramp; Overall Contact Length: -; Insulation Height: 0.320" (8.13mm); Contact Shape: Square; Contact Finish - Mating: Gold; Contact Finish Thickness - Mating: 3µin (0.08µm); Contact Finish - Post: Tin; Contact Material: Phosphor Bronze; Insulation Material: Liquid Crystal Polymer (LCP); Features: -; Operating Temperature: -55°C ~ 125°C; Ingress Protection: -; Insulation Color: Natural; Current Rating: -; Mated Stacking Heights: -; Contact Finish Thickness - Post: -; Applications: -; ComponentLink1URL: http://suddendocs.samtec.com/prints/ipl1-1xx-xx-xxx-s-xx-x-xx-mkt.pdf; ComponentLink1Description: http://suddendocs.samtec.com/prints/ipl1-1xx-xx-xxx-s-xx-x-xx-mkt.pdf
P11 = Header 4: Header, 4-Pin; LatestRevisionDate: 17-Jul-2002; LatestRevisionNote: Re-released for DXP Platform.; Publisher: Altium Limited
Q1-Q6 = CMP-1058-00341-1: Power MOSFET, 30 V, 117 A, Single N-Channel, 3-Pin DPAK, Pb-Free, Tape and Reel; Manufacturer: On Semiconductor; Coss Typ (pF): 952; Qrr Typ (nC): 30; VGS Max (V): 20; ID Max (A): 117; Crss Typ (pF): 556; Channel Polarity: N Channel; Ciss Typ (pF): 4490; VGS(th) Max (V): 2.5; ComponentLink2Description: Datasheet; ComponentLink3Description: Package Specification; Mounting Technology: Surface Mount; PackageDescription: 3-Pin Flange Mount, Body 6.54 x 6.095 mm, Pitch 2.29 mm; PackageVersion: Rev. B, 06/2010; PartNumber: NTD4804NT4G; ComponentLink2URL: http://www.onsemi.cn/pub_link/Collateral/NTD4804N-D.PDF; RoHS: Pb-Free; Configuration: Single; DatasheetVersion: Rev. 8; PackageReference: DPAK-3-369AA-01; ComponentLink3URL: http://www.onsemi.cn/pub_link/Collateral/369AA.PDF; ComponentLink1Description: Manufacturer URL; Packing: Tape and Reel; Package Type: DPAK-3; ComponentLink1URL: http://www.onsemi.com/; V(BR)DSS Min (V): 30; Supplier 1: Digi-Key; Supplier Part Number 1: NTD4804NT4GOSDKR-ND
R84 R85 R90 R91 R95 R96 = CMP-1013-00393-1: Manufacturer: Vishay Dale; Manufacturer Part Number: CRCW08054K99FKEA; Tolerance: ±1%; Power (Watts): 0.125W, 1/8W; Temperature Coefficient: ±100ppm/°C; Supplier 1: Digi-Key; Supplier Part Number 1: 541-4.99KCCT-ND; RoHS: RoHS Compliant; Category: Resistors; Stock 1: 93740; Pricing 1: 1=0.1, 10=0.044, 100=0.0178, 1000=0.00802, 2500=0.00696 (USD); Packaging: Cut Tape (CT); Part Status: Active; Composition: Thick Film; Features: Automotive AEC-Q200; Operating Temperature: -55°C ~ 155°C; Package / Case: 0805 (2012 Metric); Supplier Device Package: 0805; Size / Dimension: 0.079" L x 0.049" W (2.00mm x 1.25mm); Height - Seated (Max): 0.020" (0.50mm); Failure Rate: -; ComponentLink1URL: http://www.vishay.com/docs/20035/dcrcwe3.pdf; ComponentLink1Description: http://www.vishay.com/docs/20035/dcrcwe3.pdf
R86 R89 R94 R97 R98 R101-R103 = CMP-1013-00606-1: 6K98 0.125W 1% 0805 (2012 Metric)  SMD; Manufacturer: Vishay Dale; Manufacturer Part Number: CRCW08056K98FKEA; Power (Watts): 0.125W, 1/8W; Temperature Coefficient: ±100ppm/°C; Supplier 1: Digi-Key; Supplier Part Number 1: 541-6.98KCCT-ND; RoHS: RoHS Compliant; Category: Resistors; Stock 1: 34245; Pricing 1: 1=0.1, 10=0.044, 100=0.0178, 1000=0.00802, 2500=0.00696 (USD); Packaging: Cut Tape (CT); Part Status: Active; Tolerance: ±1%; Composition: Thick Film; Features: Automotive AEC-Q200; Operating Temperature: -55°C ~ 155°C; Package / Case: 0805 (2012 Metric); Supplier Device Package: 0805; Size / Dimension: 0.079" L x 0.049" W (2.00mm x 1.25mm); Height - Seated (Max): 0.020" (0.50mm); Failure Rate: -; ComponentLink1URL: http://www.vishay.com/docs/20035/dcrcwe3.pdf; ComponentLink1Description: http://www.vishay.com/docs/20035/dcrcwe3.pdf
R87 R88 R92 R93 R99 R100 = CMP-1013-00393-1: Manufacturer: Vishay Dale; Manufacturer Part Number: CRCW080575R0FKEA; Tolerance: ±1%; Power (Watts): 0.125W, 1/8W; Temperature Coefficient: ±100ppm/°C; Supplier 1: Digi-Key; Supplier Part Number 1: 541-75.0CCT-ND; RoHS: RoHS Compliant; Category: Resistors; Stock 1: 32546; Pricing 1: 1=0.1, 10=0.044, 100=0.0178, 1000=0.00802, 2500=0.00696 (USD); Packaging: Cut Tape (CT); Part Status: Active; Composition: Thick Film; Features: Automotive AEC-Q200; Operating Temperature: -55°C ~ 155°C; Package / Case: 0805 (2012 Metric); Supplier Device Package: 0805; Size / Dimension: 0.079" L x 0.049" W (2.00mm x 1.25mm); Height - Seated (Max): 0.020" (0.50mm); Failure Rate: -; ComponentLink1URL: http://www.vishay.com/docs/20035/dcrcwe3.pdf; ComponentLink1Description: http://www.vishay.com/docs/20035/dcrcwe3.pdf

## Sheet CT.SchDoc
size Tabloid
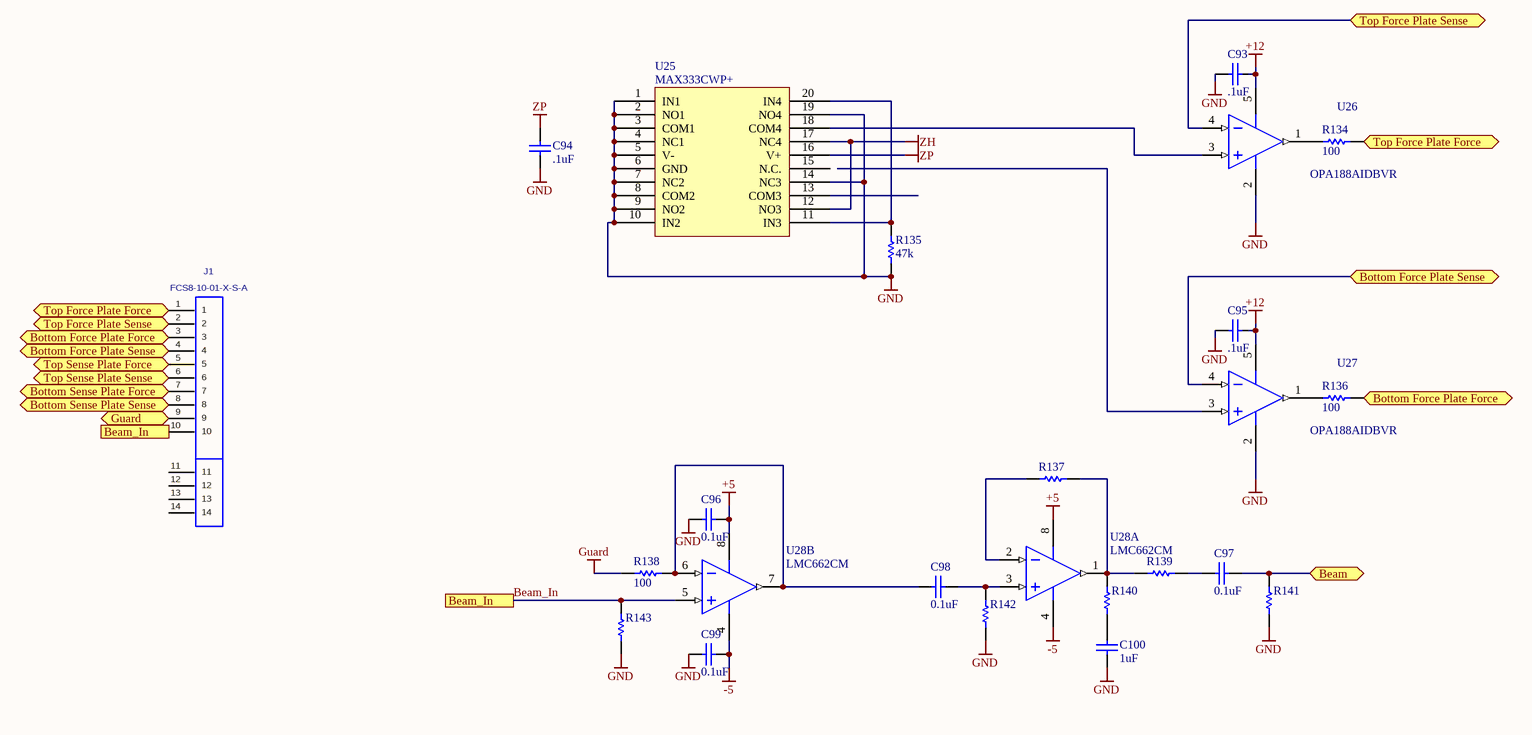
[diagram p8: CT.SchDoc]

### Parts
C93  .1uF  [CAPC0805(2012)75_M]
C94  .1uF  [CAPC0805(2012)75_L]
C95  .1uF  [CAPC0805(2012)75_M]
C96  0.1uF  [CAPC0402(1005)60_L]
C97  0.1uF  [CAPC0402(1005)60_L]
C98  0.1uF  [CAPC0402(1005)60_L]
C99  0.1uF  [CAPC0402(1005)60_L]
C100  1uF  [CAPC0402(1005)60_L]
J1  FCS8-10-01-X-S-A  [FCS8-10-01-X-S-A]
R134  100  [RESC0805(2012)_L]
R135  47k  [RESC0805(2012)_L]
R136  100  [RESC0805(2012)_L]
R137  (no value)  [RESC0402(1005)_M]
R138  100  [RESC0402(1005)_M]
R139  (no value)  [RESC0402(1005)_M]
R140  (no value)  [RESC0402(1005)_M]
R141  (no value)  [RESC0402(1005)_M]
R142  (no value)  [RESC0402(1005)_M]
R143  (no value)  [RESC0402(1005)_M]
U25  MAX333CWP+  [TSOP65P640X90-20N]
U26  OPA188AIDBVR  [DBV0005A_M]
U27  OPA188AIDBVR  [DBV0005A_M]
U28  LMC662CM  [D0008A_M]  (parts A,B of 2)

### Ports
Beam, Beam_In, Bottom Force Plate Force, Bottom Force Plate Sense, Bottom Sense Plate Force, Bottom Sense Plate Sense, Guard, Top Force Plate Force, Top Force Plate Sense, Top Sense Plate Force, Top Sense Plate Sense

### Nets
+5: C96.2 U28.8(V+)
+12: C93.2 C95.2 U26.5(V+) U27.5(V+)
-5: C99.2 U28.4(V-)
GND: C93.1 C94.1 C95.1 C96.1 C99.1 C100.1 R135.2 R141.2 R142.2 R143.1 U25.1(IN1) U25.2(NO1) U25.3(COM1) U25.4(NC1) U25.5(V-) U25.6(GND) U25.7(NC2) U25.8(COM2) U25.9(NO2) U25.10(IN2) U25.14(NC3) U25.19(NO4) U26.2(V-) U27.2(V-)
Guard: R138.2
ZH: U25.12(NO3) U25.17(NC4)
ZP: C94.2 U25.16(V+)
Beam_In: J1.10 R143.2 U28.5(INB+) ; port Beam_In
NetC97_1: C97.1 R139.1
NetC97_2: C97.2 R141.1 ; port Beam
NetC98_1: C98.1 R138.1 U28.6(INB-) U28.7(OUTB)
NetC98_2: C98.2 R142.1 U28.3(INA+)
NetC100_2: C100.2 R140.2
NetJ1_1: J1.1 R134.2 ; port Top Force Plate Force
NetJ1_2: J1.2 U26.4(IN-) ; port Top Force Plate Sense
NetJ1_3: J1.3 R136.2 ; port Bottom Force Plate Force
NetJ1_4: J1.4 U27.4(IN-) ; port Bottom Force Plate Sense
NetJ1_5: J1.5 ; port Top Sense Plate Force
NetJ1_6: J1.6 ; port Top Sense Plate Sense
NetJ1_7: J1.7 ; port Bottom Sense Plate Force
NetJ1_8: J1.8 ; port Bottom Sense Plate Sense
NetJ1_9: J1.9 ; port Guard
NetR134_1: R134.1 U26.1(OUT)
NetR135_1: R135.1 U25.11(IN3) U25.20(IN4)
NetR136_1: R136.1 U27.1(OUT)
NetR137_1: R137.1 R139.2 R140.1 U28.1(OUTA)
NetR137_2: R137.2 U28.2(INA-)
NetU25_18: U25.18(COM4) U26.3(IN+)

Not connected (* = marked no-connect by the designer): J1 11 12 13 14; U25 13(COM3) 15(N.C.); U27 3(IN+)

### Notes on the sheet
- Title
- Size:
- Date:
- Tabloid
- Number:
- Time:
- Revision:
- Sheet
- of
- ZLS Corporation
- 7801 North Lamar Blvd.
- Suite E-184
- Austin, Texas 78752  USA
- (512) 453-0288
- File:

### Library data of the parts
C93 C95 = CMP-1036-01414-1: CAP 33pF 25V ±2% 0805 (2012 Metric) Thickness 0.75mm SMD; Tolerance: Â±2%; Case-Metric: 2012; Case-EIA: 0805; Value: .1uF; Max Thickness: 0.75 mm; Rated Voltage: 25 V; Technology: SMT
C94 = CMP-1036-02117-1: CAP 150pF 16V ±10% 0805 (2012 Metric) Thickness 0.75mm SMD; Case-EIA: 0805; Tolerance: Â±10%; Case-Metric: 2012; Technology: SMT; Max Thickness: 0.75 mm; Rated Voltage: 16 V; Value: .1uF
C96-C100 = CMP-1034-00252-1: CAP CER 0.1UF 10V X7R 0402; Manufacturer: Murata Electronics North America; Manufacturer Part Number: GRM155R71A104KA01D; Tolerance: ±10%; Supplier 1: Digi-Key; Supplier Part Number 1: 490-6321-1-ND; RoHS: RoHS Compliant; Category: Capacitors; Stock 1: 2920395; Pricing 1: 1=0.1, 10=0.014, 100=0.0063, 500=0.00446, 1000=0.00351, 2500=0.00319, 5000=0.00293 (USD); Packaging: Cut Tape (CT); Part Status: Active; Voltage - Rated: 10V; Temperature Coefficient: X7R; Operating Temperature: -55°C ~ 125°C; Features: -; Ratings: -; Applications: General Purpose; Mounting Type: Surface Mount, MLCC; Package / Case: 0402 (1005 Metric); Size / Dimension: 0.039" L x 0.020" W (1.00mm x 0.50mm); Height - Seated (Max): -; Thickness (Max): 0.022" (0.55mm); Lead Spacing: -; ComponentLink1URL: http://www.murata.com/~/media/webrenewal/support/library/catalog/products/capacitor/mlcc/c02e.ashx?la=en-us; ComponentLink1Description: http://www.murata.com/~/media/webrenewal/support/library/catalog/products/capacitor/mlcc/c02e.ashx?la=en-us
J1 = FCS8-10-01-X-S-A: FCS8 Socket Assembly, 20-Pins, w/ Alignment Pins; MANUFACTURER: SAMTEC; CREATED: 31 NOV 2013 - WENDY XIN; PCB DECAL: FCS8-10-01-X-S-A
R134-R136 = CMP-1013-00215-1: 2R55 0.125W 1% 0805 (2012 Metric)  SMD; Case-Metric: 2012; Case-EIA: 0805; Tolerance: 1 %; Technology: SMT; Power: 0.125 W
  R134 R136: Value: 100
  R135: Value: 47k
R137-R143 = CMP-1011-00463-1
U25 = MAX333CWP+: IC SWITCH QUAD SPDT 20TSSOP; Manufacturer: Maxim; Manufacturer Part Number: MAX333AEUP+; Max Supply Voltage: 30V; Min Supply Voltage: 10V; Min Dual Supply Voltage: 4.5V; Max Dual Supply Voltage: 20V; On-State Resistance: 35R; Operating Supply Current: 1uA; Supply Type: Single,Dual; Max Power Dissipation: 559mW; Turn-On Delay Time: 175ns; Turn-Off Delay Time: 145ns; Max Supply Current: 250uA; Number of Bits: 4; Dual Supply Voltage: 15V; Supplier 1: Mouser; Supplier Part Number 1: 700-MAX333AEUP; Stock 1: 664; Pricing 1: 1=6.77, 10=6.43, 50=5.8, 100=5.8, 1000=5.62, 10000=5.62 (USD); Case/Package: TSSOP; Number of Pins: 20; Weight: 0.006737oz; Min Operating Temperature: -40°C; Max Operating Temperature: 85°C; Packaging: Rail/Tube; Package Quantity: 74; Throw Configuration: SPDT; Number of Channels: 4; Length: 6.6mm; Height: 0.95mm; Width: 4.5mm; Radiation Hardening: No; Lead Free: Lead Free; REACH SVHC: Unknown; ComponentLink1URL: https://datasheet.ciiva.com/2978/max333a-2978850.pdf; ComponentLink1Description: https://datasheet.ciiva.com/2978/max333a-2978850.pdf; ComponentLink2URL: https://datasheet.ciiva.com/30478/0900766b81253c85-30478260.pdf; ComponentLink2Description: https://datasheet.ciiva.com/30478/0900766b81253c85-30478260.pdf; ComponentLink3URL: https://datasheet.ciiva.com/1674/max333a-1674617.pdf; ComponentLink3Description: https://datasheet.ciiva.com/1674/max333a-1674617.pdf; ComponentLink4URL: https://datasheet.ciiva.com/26825/max333aeup-26825546.pdf; ComponentLink4Description: https://datasheet.ciiva.com/26825/max333aeup-26825546.pdf
U26 U27 = CMP-0809-00005-2: Precision, Low Noise, Rail-to-Rail Output, Zero-Drift Operational Amplifier, 4 to 36 V, -40 to 125 degC, 5-pin SOT23 (DBV5), Green (RoHS & no Sb/Br); Manufacturer: Texas Instruments; Total Supply Voltage(Min)(+5V is 5, +/-5V is 10): 4; Offset Drift(Typ)(uV/C): 0.03; Rating: Catalog; SubFamily: Zero Drift Precision Amplifier; GBW(Typ)(MHz): 2; Slew Rate(Typ)(V/us): 0.8; Number of Channels: 1; CMRR(Min)(dB): 120; Iq per channel(Max)(mA): 0.51; Total Supply Voltage(Max)(+5V is 5, +/-5V is 10): 36; PartNumber: OPA188AIDBVR; ComponentLink2Description: Datasheet; ComponentLink2URL: http://www.ti.com/lit/ds/symlink/opa188.pdf; ComponentLink1Description: Manufacturer URL; Mounting Technology: Surface Mount; Eco-Plan: Green (RoHS & no Sb/Br); ComponentLink1URL: http://www.ti.com/; PackageVersion: 4073253-4/K, 03/2006; DatasheetVersion: SBOS642A; ComponentLink3Description: Package Specification; PackageReference: DBV0005A; ComponentLink3URL: http://www.ti.com/litv/pdf/mpds018i; PackageDescription: 5-Pin Plastic Small Outline, Body 1.6 x 2.9 mm, Pitch 0.95 mm; Code_JEDEC: MO-178
U28 = CMP-0055-00893-3: CMOS Dual Operational Amplifier, 8-pin Narrow SOIC; Manufacturer: Texas Instruments; PowerWise: N; CompType: Amplifiers; PackageTopMarking: NSZXTT*LMC66*2CM; RoHS: N; ComponentLink1Description: Datasheet URL; PinCount: 8; Code_IPC: SOIC127P600-8; ComponentLink1URL: http://www.ti.com/general/docs/lit/getliterature.tsp?genericPartNumber=LMC662&fileType=pdf; Code_JEDEC: MS-012-AA; PackageDescription: SOIC Narrow, 4.9 x 3.9 x 1.45mm, 8 Lead, 1.27mm Pitch; Package Reference: D0008A; PartId: 1